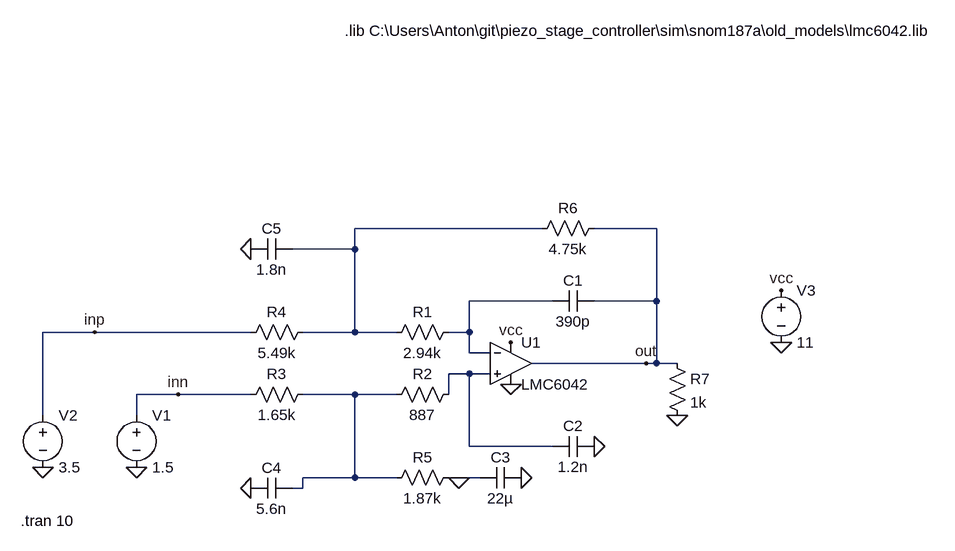
[diagram p0: schematic output_amp_sim.asc]
output_amp_sim.asc, the LTspice schematic file:
Version 4
SHEET 1 1116 680
WIRE 384 -48 96 -48
WIRE 560 -48 464 -48
WIRE 96 -16 96 -48
WIRE 96 -16 0 -16
WIRE 400 64 272 64
WIRE 560 64 560 -48
WIRE 560 64 464 64
WIRE -304 112 -384 112
WIRE -64 112 -304 112
WIRE 96 112 96 -16
WIRE 96 112 16 112
WIRE 160 112 96 112
WIRE 272 112 272 64
WIRE 272 112 240 112
WIRE 272 144 272 112
WIRE 304 144 272 144
WIRE 544 160 368 160
WIRE 560 160 560 64
WIRE 560 160 544 160
WIRE 592 160 560 160
WIRE 272 176 240 176
WIRE 304 176 272 176
WIRE -176 208 -240 208
WIRE -64 208 -176 208
WIRE 96 208 16 208
WIRE 160 208 96 208
WIRE 240 208 240 176
WIRE -384 240 -384 112
WIRE -240 240 -240 208
WIRE 272 288 272 176
WIRE 400 288 272 288
WIRE 96 336 96 208
WIRE 96 336 16 336
WIRE 160 336 96 336
WIRE 256 336 240 336
WIRE 288 336 256 336
WIRE 16 352 16 336
WIRE 16 352 0 352
FLAG -240 320 0
FLAG -384 320 0
FLAG -64 352 0
FLAG -64 -16 0
FLAG 464 288 0
FLAG 352 336 0
FLAG -304 112 inp
FLAG -176 208 inn
FLAG 544 160 out
FLAG 752 128 0
FLAG 752 48 vcc
FLAG 336 128 vcc
FLAG 336 192 0
FLAG 592 240 0
FLAG 256 336 0
SYMBOL res 256 96 R90
WINDOW 0 0 56 VBottom 2
WINDOW 3 32 56 VTop 2
SYMATTR InstName R1
SYMATTR Value 2.94k
SYMBOL res 32 192 R90
WINDOW 0 0 56 VBottom 2
WINDOW 3 32 56 VTop 2
SYMATTR InstName R3
SYMATTR Value 1.65k
SYMBOL res 32 96 R90
WINDOW 0 0 56 VBottom 2
WINDOW 3 32 56 VTop 2
SYMATTR InstName R4
SYMATTR Value 5.49k
SYMBOL res 256 320 R90
WINDOW 0 0 56 VBottom 2
WINDOW 3 32 56 VTop 2
SYMATTR InstName R5
SYMATTR Value 1.87k
SYMBOL res 480 -64 R90
WINDOW 0 0 56 VBottom 2
WINDOW 3 32 56 VTop 2
SYMATTR InstName R6
SYMATTR Value 4.75k
SYMBOL cap 464 48 R90
WINDOW 0 0 32 VBottom 2
WINDOW 3 32 32 VTop 2
SYMATTR InstName C1
SYMATTR Value 390p
SYMBOL cap 464 272 R90
WINDOW 0 0 32 VBottom 2
WINDOW 3 32 32 VTop 2
SYMATTR InstName C2
SYMATTR Value 1.2n
SYMBOL cap 352 320 R90
WINDOW 0 0 32 VBottom 2
WINDOW 3 32 32 VTop 2
SYMATTR InstName C3
SYMATTR Value 22µ
SYMBOL cap 0 336 R90
WINDOW 0 0 32 VBottom 2
WINDOW 3 32 32 VTop 2
SYMATTR InstName C4
SYMATTR Value 5.6n
SYMBOL cap 0 -32 R90
WINDOW 0 0 32 VBottom 2
WINDOW 3 32 32 VTop 2
SYMATTR InstName C5
SYMATTR Value 1.8n
SYMBOL voltage -240 224 R0
WINDOW 123 0 0 Left 0
WINDOW 39 0 0 Left 0
SYMATTR InstName V1
SYMATTR Value 1.5
SYMBOL voltage -384 224 R0
WINDOW 123 0 0 Left 0
WINDOW 39 0 0 Left 0
SYMATTR InstName V2
SYMATTR Value 3.5
SYMBOL OpAmps\\opamp2 336 96 R0
SYMATTR InstName U1
SYMATTR Value LMC6042
SYMBOL voltage 752 32 R0
WINDOW 123 0 0 Left 0
WINDOW 39 0 0 Left 0
SYMATTR InstName V3
SYMATTR Value 11
SYMBOL res 256 192 R90
WINDOW 0 0 56 VBottom 2
WINDOW 3 32 56 VTop 2
SYMATTR InstName R2
SYMATTR Value 887
SYMBOL res 576 144 R0
SYMATTR InstName R7
SYMATTR Value 1k
TEXT 80 -352 Left 2 !.lib C:\\Users\\Anton\\git\\piezo_stage_controller\\sim\\snom187a\\old_models\\lmc6042.lib
TEXT -418 402 Left 2 !.tran 10

The netlist it stands for:
* output_amp_sim.asc
R1 N002 N001 2.94k
R3 N004 inn 1.65k
R4 N001 inp 5.49k
R5 0 N004 1.87k
R6 out N001 4.75k
C1 out N002 390p
C2 0 N003 1.2n
C3 0 0 22µ
C4 N004 0 5.6n
C5 N001 0 1.8n
V1 inn 0 1.5
V2 inp 0 3.5
XU1 N003 N002 vcc 0 out LMC6042  ; pins In+ In- V+ V- OUT
V3 vcc 0 11
R2 N003 N004 887
R7 out 0 1k
.lib C:\Users\Anton\git\piezo_stage_controller\sim\snom187a\old_models\lmc6042.lib
.tran 10
.backanno
.end